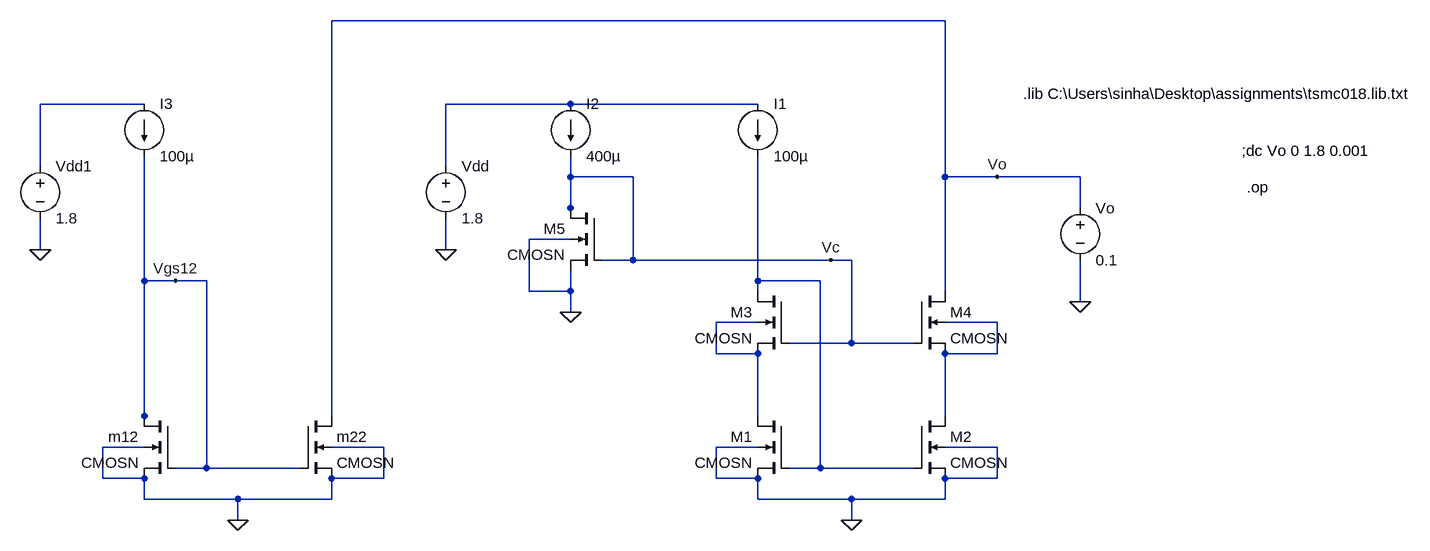
[diagram p0: schematic Q4b.asc]
Q4b.asc, the LTspice schematic file:
Version 4
SHEET 1 1424 680
WIRE 448 -512 -496 -512
WIRE -784 -384 -944 -384
WIRE -128 -384 -320 -384
WIRE 160 -384 -128 -384
WIRE -944 -288 -944 -384
WIRE -320 -288 -320 -384
WIRE -128 -272 -128 -304
WIRE -32 -272 -128 -272
WIRE 448 -272 448 -512
WIRE 528 -272 448 -272
WIRE 656 -272 528 -272
WIRE -128 -224 -128 -272
WIRE 656 -224 656 -272
WIRE -128 -208 -128 -224
WIRE -128 -176 -192 -176
WIRE -944 -160 -944 -208
WIRE -320 -160 -320 -208
WIRE -32 -144 -32 -272
WIRE -32 -144 -80 -144
WIRE 272 -144 -32 -144
WIRE 304 -144 272 -144
WIRE -784 -112 -784 -304
WIRE -736 -112 -784 -112
WIRE -688 -112 -736 -112
WIRE 160 -112 160 -304
WIRE 256 -112 160 -112
WIRE -192 -96 -192 -176
WIRE -128 -96 -128 -128
WIRE -128 -96 -192 -96
WIRE 160 -96 160 -112
WIRE 448 -96 448 -272
WIRE 656 -80 656 -144
WIRE -128 -64 -128 -96
WIRE 160 -48 96 -48
WIRE 528 -48 448 -48
WIRE 304 -16 304 -144
WIRE 304 -16 208 -16
WIRE 400 -16 304 -16
WIRE 96 0 96 -48
WIRE 160 0 96 0
WIRE 528 0 528 -48
WIRE 528 0 448 0
WIRE -784 96 -784 -112
WIRE -496 96 -496 -512
WIRE 160 96 160 0
WIRE 448 96 448 0
WIRE -784 112 -784 96
WIRE -784 144 -848 144
WIRE -416 144 -496 144
WIRE 160 144 96 144
WIRE 528 144 448 144
WIRE -688 176 -688 -112
WIRE -688 176 -736 176
WIRE -544 176 -688 176
WIRE 256 176 256 -112
WIRE 256 176 208 176
WIRE 400 176 256 176
WIRE -848 192 -848 144
WIRE -784 192 -848 192
WIRE -416 192 -416 144
WIRE -416 192 -496 192
WIRE 96 192 96 144
WIRE 160 192 96 192
WIRE 528 192 528 144
WIRE 528 192 448 192
WIRE -784 224 -784 192
WIRE -640 224 -784 224
WIRE -496 224 -496 192
WIRE -496 224 -640 224
WIRE 160 224 160 192
WIRE 304 224 160 224
WIRE 448 224 448 192
WIRE 448 224 304 224
WIRE -640 256 -640 224
WIRE 304 256 304 224
FLAG 304 256 0
FLAG -320 -160 0
FLAG -128 -64 0
FLAG 656 -80 0
FLAG -640 256 0
FLAG -944 -160 0
FLAG 528 -272 Vo
FLAG 272 -144 Vc
FLAG -736 -112 Vgs12
SYMBOL nmos4 208 -96 M0
SYMATTR InstName M3
SYMATTR Value CMOSN
SYMATTR Value2 l=180n w=1800n
SYMBOL nmos4 208 96 M0
SYMATTR InstName M1
SYMATTR Value CMOSN
SYMATTR Value2 l=180n w=1800n
SYMBOL nmos4 400 -96 R0
SYMATTR InstName M4
SYMATTR Value CMOSN
SYMATTR Value2 l=180n w=1800n
SYMBOL nmos4 400 96 R0
SYMATTR InstName M2
SYMATTR Value CMOSN
SYMATTR Value2 l=180n w=1800n
SYMBOL voltage -320 -304 R0
WINDOW 123 0 0 Left 0
WINDOW 39 0 0 Left 0
SYMATTR InstName Vdd
SYMATTR Value 1.8
SYMBOL current 160 -384 R0
WINDOW 123 0 0 Left 0
WINDOW 39 0 0 Left 0
SYMATTR InstName I1
SYMATTR Value 100µ
SYMBOL current -128 -384 R0
WINDOW 123 0 0 Left 0
WINDOW 39 0 0 Left 0
SYMATTR InstName I2
SYMATTR Value 400µ
SYMBOL nmos4 -80 -224 M0
SYMATTR InstName M5
SYMATTR Value CMOSN
SYMATTR Value2 l=180n w=1800n
SYMBOL voltage 656 -240 R0
WINDOW 123 0 0 Left 0
WINDOW 39 0 0 Left 0
SYMATTR InstName Vo
SYMATTR Value 0.1
SYMBOL nmos4 -736 96 M0
SYMATTR InstName m12
SYMATTR Value CMOSN
SYMATTR Value2 l=180n w=1800n
SYMBOL nmos4 -544 96 R0
SYMATTR InstName m22
SYMATTR Value CMOSN
SYMATTR Value2 l=180n w=1800n
SYMBOL voltage -944 -304 R0
WINDOW 123 0 0 Left 0
WINDOW 39 0 0 Left 0
SYMATTR InstName Vdd1
SYMATTR Value 1.8
SYMBOL current -784 -384 R0
WINDOW 123 0 0 Left 0
WINDOW 39 0 0 Left 0
SYMATTR InstName I3
SYMATTR Value 100µ
TEXT 568 -400 Left 2 !.lib C:\\Users\\sinha\\Desktop\\assignments\\tsmc018.lib.txt
TEXT 904 -312 Left 2 !;dc Vo 0 1.8 0.001
TEXT 912 -256 Left 2 !.op

The netlist it stands for:
* Q4b.asc
M3 N003 Vc N004 N004 CMOSN l=180n w=1800n
M1 N004 N003 0 0 CMOSN l=180n w=1800n
M4 Vo Vc N005 N005 CMOSN l=180n w=1800n
M2 N005 N003 0 0 CMOSN l=180n w=1800n
Vdd N002 0 1.8
I1 N002 N003 100µ
I2 N002 Vc 400µ
M5 Vc Vc 0 0 CMOSN l=180n w=1800n
Vo Vo 0 0.1
m12 Vgs12 Vgs12 0 0 CMOSN l=180n w=1800n
m22 Vo Vgs12 0 0 CMOSN l=180n w=1800n
Vdd1 N001 0 1.8
I3 N001 Vgs12 100µ
.model NMOS NMOS
.model PMOS PMOS
.lib standard.mos
.lib C:\Users\sinha\Desktop\assignments\tsmc018.lib.txt
;dc Vo 0 1.8 0.001
.op
.backanno
.end